# EAGLE design brick_i2c_gyro_l3gd20 (EAGLE 7.2.0)
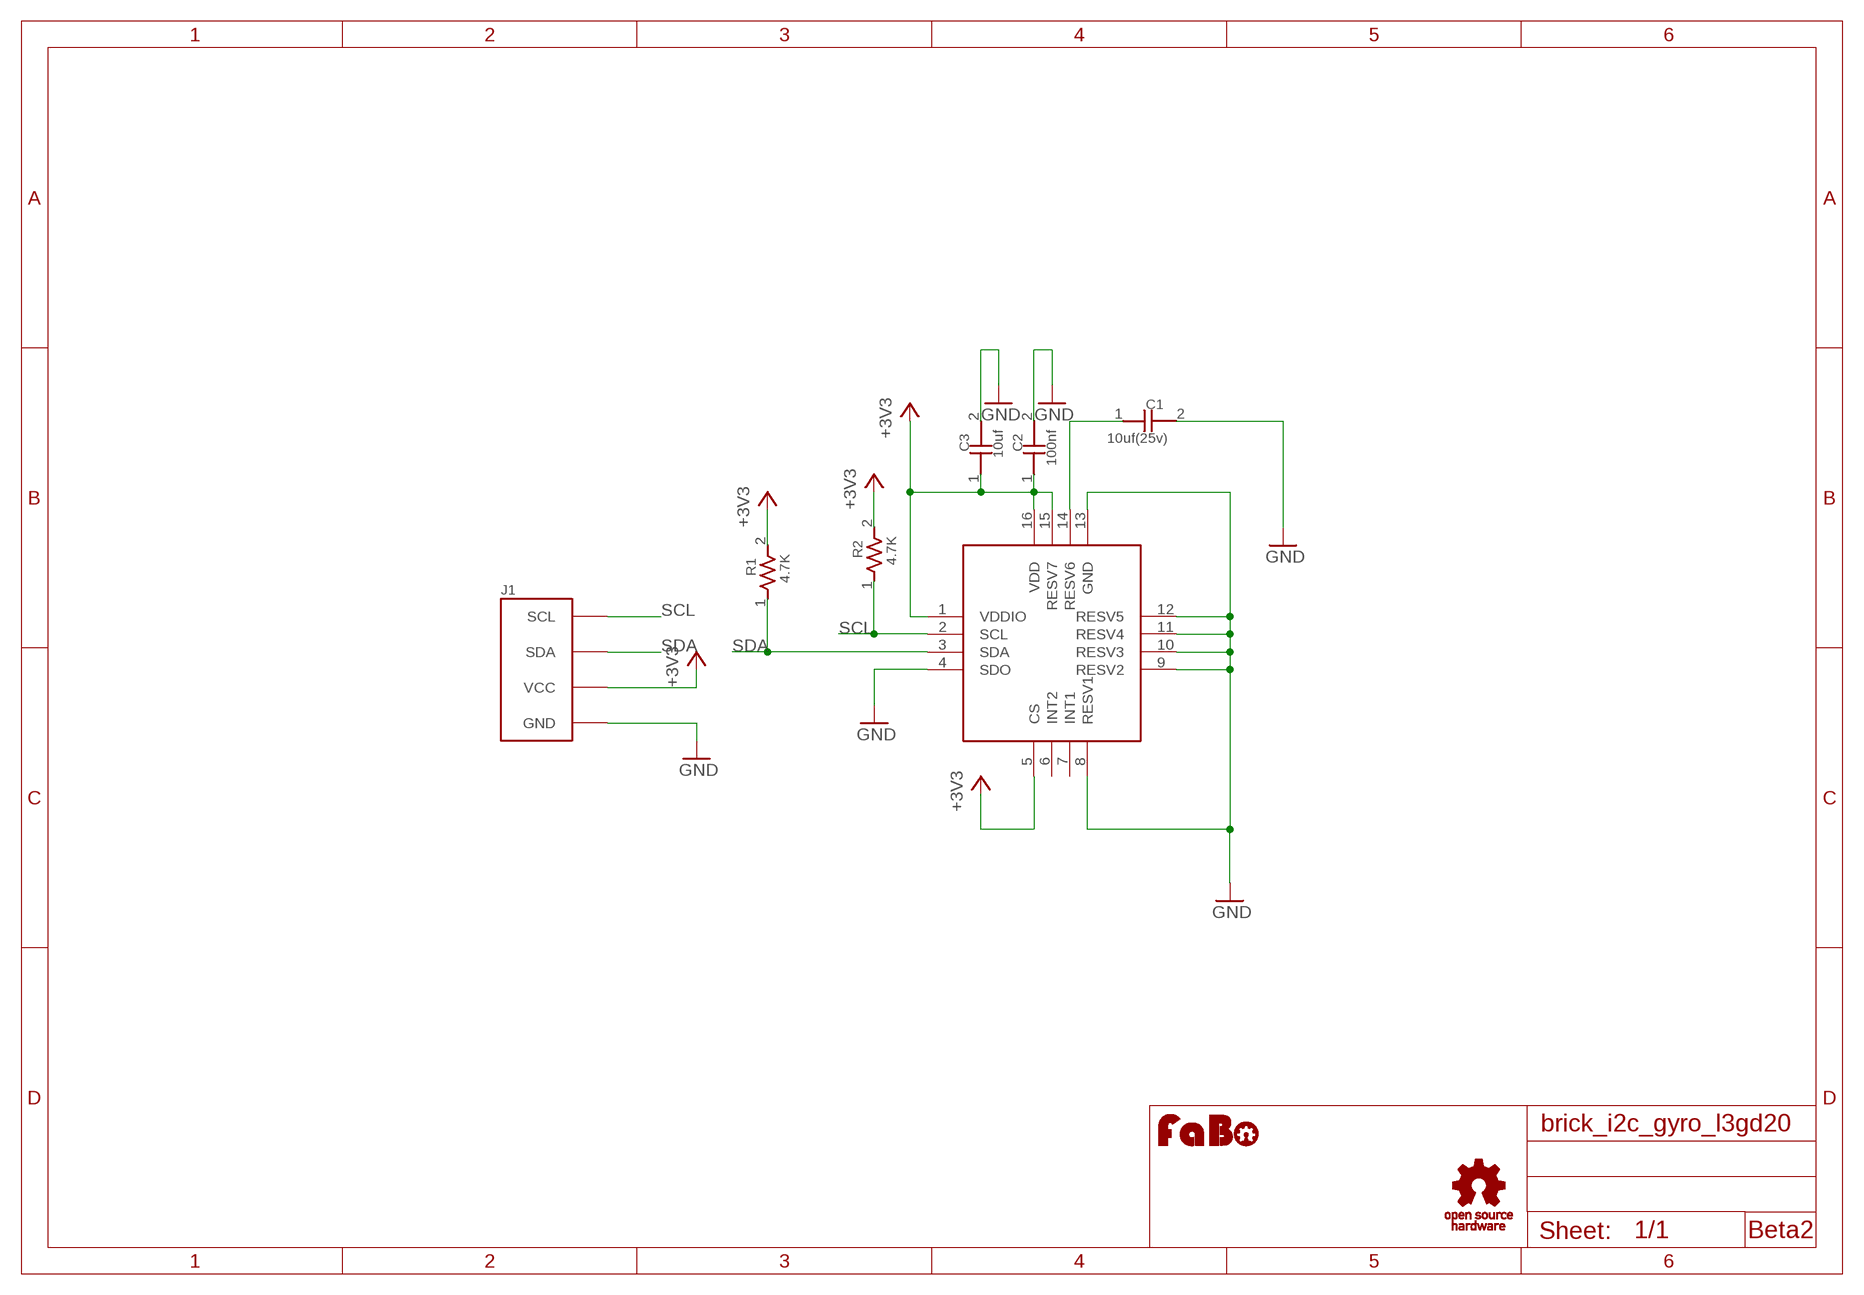
[diagram p0: schematic, sheet 1]

## Parts
C1  10uf(25v)  CAPACITOR0603  [0603]
C2  100nf  CAPACITOR0603  [0603]
C3  10uf  CAPACITOR0603  [0603]
J1  BRICK_I2C  [BRICK_I2C]
R1  4.7K  RESISTOR0603  [0603]
R2  4.7K  RESISTOR0603  [0603]
U$1  LOGO_OSHW_T-M  [LOGO_OSHW_T_M]
U$3  ST-L3GD20  [LGA-16]
U$4  LOGO_FABO-M  [LOGO_FABO_M]

## Nets
+3V3: C2.1 C3.1 J1.VCC R1.2 R2.2 U$3.1(VDDIO) U$3.5(CS) U$3.15(RESV7) U$3.16(VDD)
GND: C1.2 C2.2 C3.2 J1.GND U$3.4(SDO) U$3.8(RESV1) U$3.9(RESV2) U$3.10(RESV3) U$3.11(RESV4) U$3.12(RESV5) U$3.13(GND)
N$3: C1.1 U$3.14(RESV6)
SCL: J1.SCL R2.1 U$3.2(SCL)
SDA: J1.SDA R1.1 U$3.3(SDA)
Unconnected: U$3.6(INT2) U$3.7(INT1)

## Notes on the sheet
- Beta2

## Library data of the parts
C1-C3 = GClue-Capacitor:CAPACITOR
J1 = gclue:BRICK_I2C: FaBo Brick 4pin(I2C)
R1 R2 = GClue-Resistors:RESISTOR
U$1 = gclue:LOGO_OSHW_T
U$3 = GClue-Mems:ST-L3GD20
U$4 = FaBo:LOGO_FABO

## Board
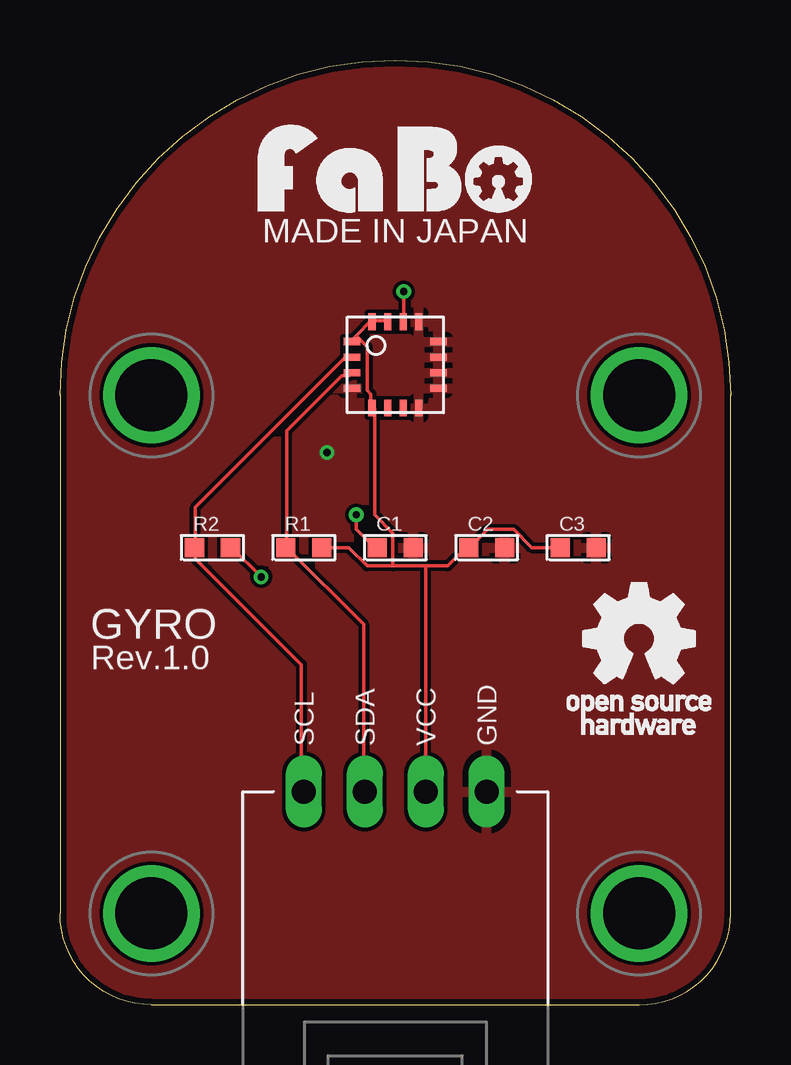
[diagram p1: board, top side]
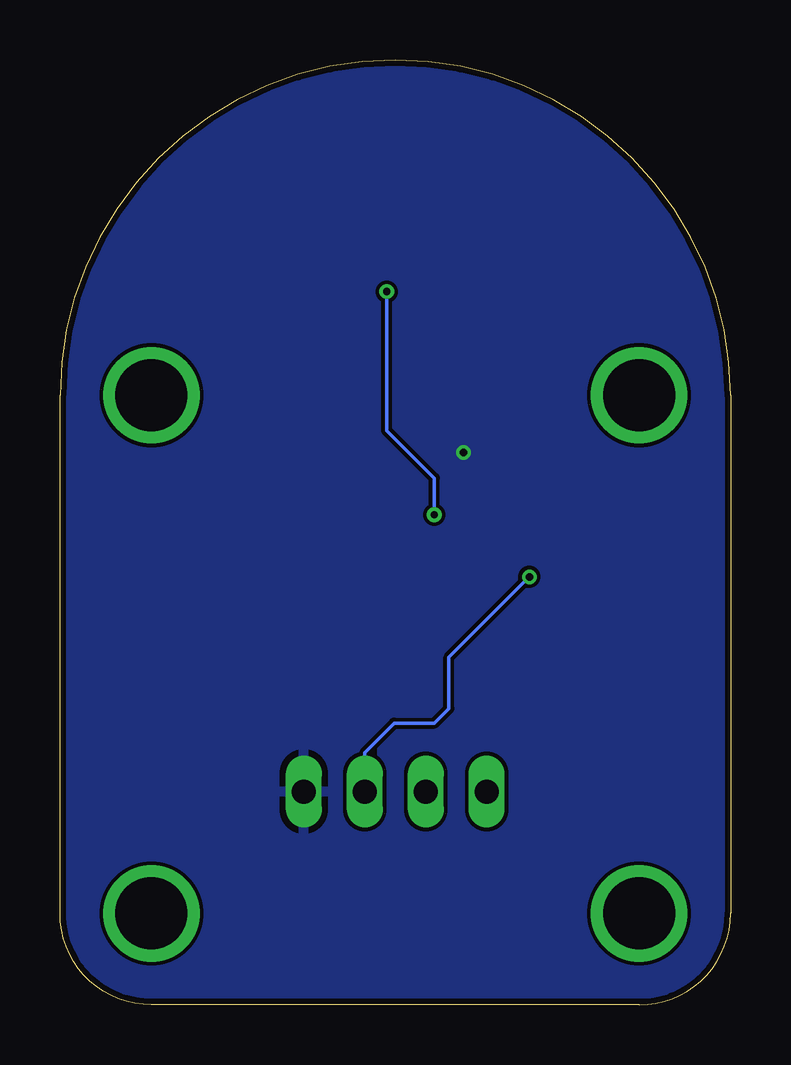
[diagram p2: board, bottom side, seen from below]

Size 27.94 x 39.37 mm. Coordinates in mm from the lower left corner, seen from the top.
Copper layers (1*16): Top 0.035mm / dielectric 1.5mm / Bottom 0.035mm
Design rules "Elecrow_2-layer_eagle_rule": minimum track width 6mil, minimum drill 12mil, track to track 6mil, track to pad 6mil, pad to pad 6mil, via to via 6mil, smd to smd 0mil, copper to edge 10mil, drill to drill 10mil, minimum pad ring 10mil, minimum via ring 6mil, stop-mask expansion 2mil, vias tented up to drill 100mil, thermal gap 10mil

### Footprints (pad centres in the part's own frame; a part is rotated, then mirrored left to right if it is on the bottom)
0603 = smd 0.8 x 0.8: 1 -0.75,0; 2 0.75,0
BRICK_I2C = drill 1 long: GND 3.81,-10.16; SCL -3.81,-10.16; SDA -1.27,-10.16; VCC 1.27,-10.16 | drill 3 pad 3.81: P$1 -10.16,6.35; P$2 10.16,6.35; P$3 -10.16,-15.24; P$4 10.16,-15.24
LGA-16 = smd 0.7 x 0.3: 1 -1.8,0.97; 2 -1.8,0.32; 3 -1.8,-0.33; 4 -1.8,-0.98; 9 1.8,-0.98; 10 1.8,-0.33; 11 1.8,0.32; 12 1.8,0.97 | smd 0.3 x 0.7: 5 -0.97,-1.8; 6 -0.32,-1.8; 7 0.33,-1.8; 8 0.98,-1.8; 13 0.98,1.8; 14 0.33,1.8; 15 -0.32,1.8; 16 -0.97,1.8

### Placement (x,y rotation side)
C1  13.97,19.05 0 top
C2  17.78,19.05 0 top
C3  21.59,19.05 0 top
J1  13.97,19.05 0 top
R1  10.16,19.05 0 top
R2  6.35,19.05 0 top
U$1  24.13,15.24 0 top
U$3  13.97,26.67 0 top
U$4  13.97,33.02 0 top

### Tracks (layer width: path | path; a pad name or v marks a point on that pad's centre or on a via)
+3V3  (via drill 0.3)
  Top 0.152: 12.34,27.89 12.95,28.5 U$3.16 13.11,28.5 13.56,28.5 U$3.15 | 12.34,27.89 12.19,27.74 U$3.1 | 12.34,27.89 12.8,27.43 12.8,25.6 12.95,25.45 12.95,24.99 U$3.5 13.11,24.84 13.11,20.42 13.87,19.66 13.87,18.29 | R1.2 12.04,19.05 12.8,18.29 13.87,18.29 | 15.24,18.29 16.15,18.29 16.92,19.05 C2.1 17.07,19.05 17.83,19.81 18.9,19.81 19.66,19.05 C3.1 | 15.24,18.29 13.87,18.29 | v8.38,17.83 7.16,19.05 R2.2 | J1.VCC 15.24,18.29
  Bottom 0.152: v8.38,17.83 11.73,14.48 11.73,12.34 12.34,11.73 14.02,11.73 15.24,10.52 J1.VCC
GND  (via drill 0.3)
  other vias: 11.13,23.01
  pour Bottom: -1.27,-1.27 29.21,-1.27 29.21,40.64 -1.27,40.64
  pour Top: -1.27,-1.27 29.21,-1.27 29.21,40.64 -1.27,40.64
N$3  (via drill 0.3)
  Top 0.152: v14.33,29.72 14.33,28.5 U$3.14 | v12.34,20.42 12.34,19.81 13.11,19.05 C1.1
  Bottom 0.152: v12.34,20.42 12.34,21.95 14.33,23.93 v14.33,29.72
SCL
  Top 0.152: 5.64,19.05 5.64,20.73 11.89,26.98 12.04,26.98 U$3.2 | 5.64,19.05 5.64,18.59 10.06,14.17 10.06,8.99 J1.SCL | 5.64,19.05 R2.1
SDA
  Top 0.152: 9.45,19.05 9.45,23.93 11.73,26.21 12.04,26.21 U$3.3 | 9.45,19.05 12.65,15.85 12.65,8.99 J1.SDA | 9.45,19.05 R1.1

### Text on the board
tPlace: MADE IN JAPAN | GYRO | Rev.1.0